# Altium schematic sheet FPGA_IO_3.SchDoc
size A
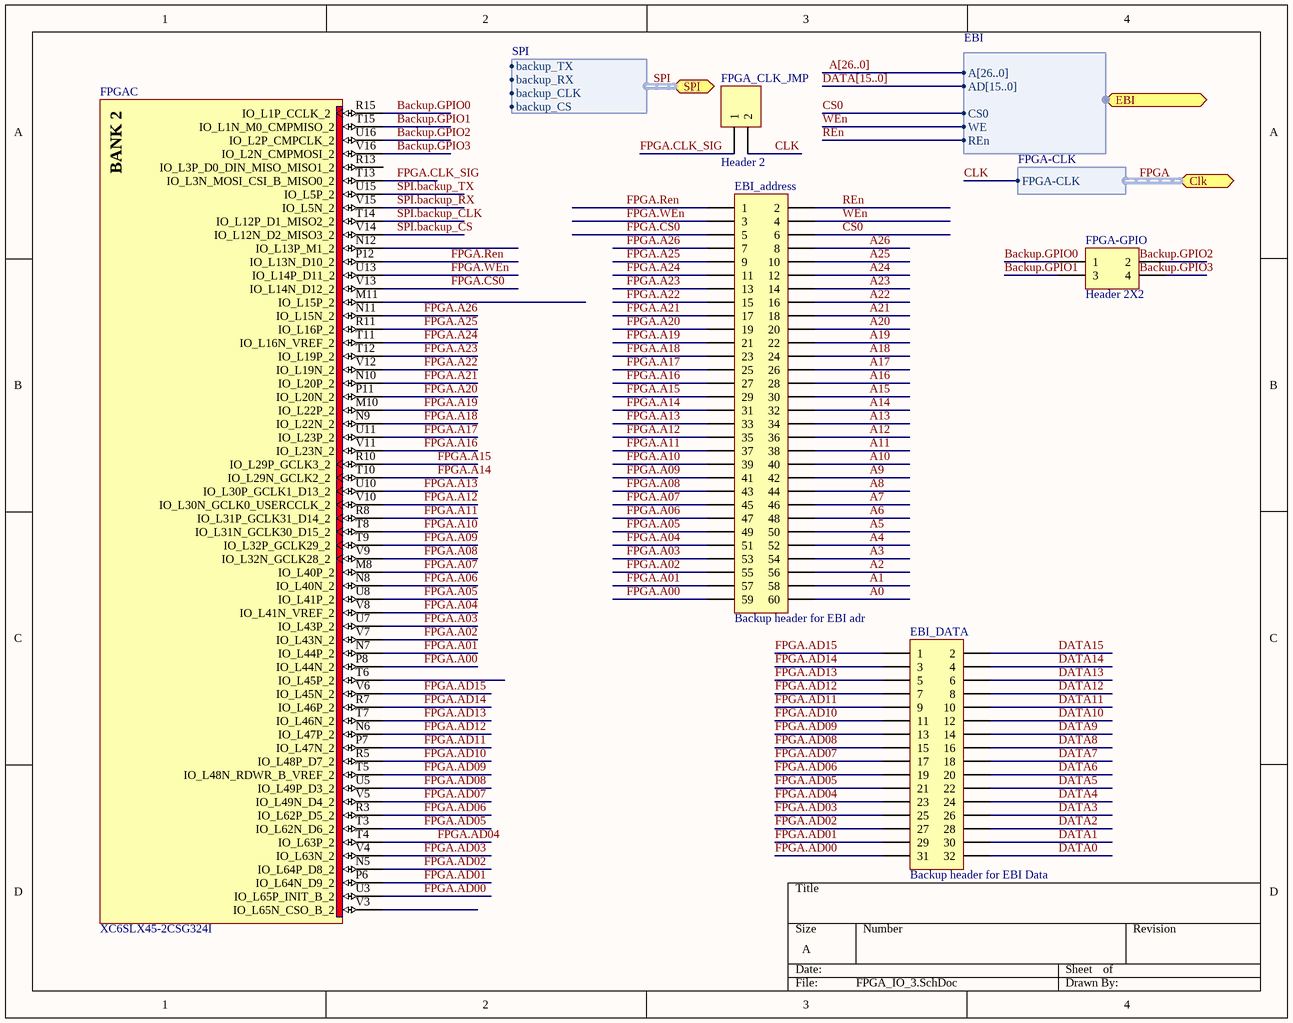
[diagram p0: FPGA_IO_3.SchDoc]

## Parts
EBI_address  Backup header for EBI adr  [HDR2X30]
EBI_DATA  Backup header for EBI Data  [HDR2X16]
FPGA  XC6SLX45-2CSG324I  [CSG324]  (part C of 8)
FPGA-GPIO  Header 2X2  [HDR2X2]
FPGA_CLK_JMP  Header 2  [HDR1X2]

## Ports
Clk (harness FPGA-CLK), EBI (harness EBI), SPI (harness SPI)

## Harnesses
EBI: AD[15..0], A[26..0], CS0, WE, REn
FPGA-CLK: FPGA-CLK
SPI: backup_TX, backup_RX, backup_CLK, backup_CS

## Nets
A0: EBI_address.60
A1: EBI_address.58
A2: EBI_address.56
A3: EBI_address.54
A4: EBI_address.52
A5: EBI_address.50
A6: EBI_address.48
A7: EBI_address.46
A8: EBI_address.44
A9: EBI_address.42
A10: EBI_address.40
A11: EBI_address.38
A12: EBI_address.36
A13: EBI_address.34
A14: EBI_address.32
A15: EBI_address.30
A16: EBI_address.28
A17: EBI_address.26
A18: EBI_address.24
A19: EBI_address.22
A20: EBI_address.20
A21: EBI_address.18
A22: EBI_address.16
A23: EBI_address.14
A24: EBI_address.12
A25: EBI_address.10
A26: EBI_address.8
Backup.GPIO0: FPGA.R15(IO_L1P_CCLK_2) FPGA-GPIO.1
Backup.GPIO1: FPGA.T15(IO_L1N_M0_CMPMISO_2) FPGA-GPIO.3
Backup.GPIO2: FPGA.U16(IO_L2P_CMPCLK_2)
Backup.GPIO3: FPGA.V16(IO_L2N_CMPMOSI_2)
CLK: FPGA_CLK_JMP.2 ; port Clk.FPGA-CLK
CS0: EBI_address.6 ; port EBI.CS0
DATA0: EBI_DATA.32
DATA1: EBI_DATA.30
DATA2: EBI_DATA.28
DATA3: EBI_DATA.26
DATA4: EBI_DATA.24
DATA5: EBI_DATA.22
DATA6: EBI_DATA.20
DATA7: EBI_DATA.18
DATA8: EBI_DATA.16
DATA9: EBI_DATA.14
DATA10: EBI_DATA.12
DATA11: EBI_DATA.10
DATA12: EBI_DATA.8
DATA13: EBI_DATA.6
DATA14: EBI_DATA.4
DATA15: EBI_DATA.2
FPGA.A00: EBI_address.59 FPGA.P8(IO_L44N_2)
FPGA.A01: EBI_address.57 FPGA.N7(IO_L44P_2)
FPGA.A02: EBI_address.55 FPGA.V7(IO_L43N_2)
FPGA.A03: EBI_address.53 FPGA.U7(IO_L43P_2)
FPGA.A04: EBI_address.51 FPGA.V8(IO_L41N_VREF_2)
FPGA.A05: EBI_address.49 FPGA.U8(IO_L41P_2)
FPGA.A06: EBI_address.47 FPGA.N8(IO_L40N_2)
FPGA.A07: EBI_address.45 FPGA.M8(IO_L40P_2)
FPGA.A08: EBI_address.43 FPGA.V9(IO_L32N_GCLK28_2)
FPGA.A09: EBI_address.41 FPGA.T9(IO_L32P_GCLK29_2)
FPGA.A10: EBI_address.39 FPGA.T8(IO_L31N_GCLK30_D15_2)
FPGA.A11: EBI_address.37 FPGA.R8(IO_L31P_GCLK31_D14_2)
FPGA.A12: EBI_address.35 FPGA.V10(IO_L30N_GCLK0_USERCCLK_2)
FPGA.A13: EBI_address.33 FPGA.U10(IO_L30P_GCLK1_D13_2)
FPGA.A14: EBI_address.31 FPGA.T10(IO_L29N_GCLK2_2)
FPGA.A15: EBI_address.29 FPGA.R10(IO_L29P_GCLK3_2)
FPGA.A16: EBI_address.27 FPGA.V11(IO_L23N_2)
FPGA.A17: EBI_address.25 FPGA.U11(IO_L23P_2)
FPGA.A18: EBI_address.23 FPGA.N9(IO_L22N_2)
FPGA.A19: EBI_address.21 FPGA.M10(IO_L22P_2)
FPGA.A20: EBI_address.19 FPGA.P11(IO_L20N_2)
FPGA.A21: EBI_address.17 FPGA.N10(IO_L20P_2)
FPGA.A22: EBI_address.15 FPGA.V12(IO_L19N_2)
FPGA.A23: EBI_address.13 FPGA.T12(IO_L19P_2)
FPGA.A24: EBI_address.11 FPGA.T11(IO_L16N_VREF_2)
FPGA.A25: EBI_address.9 FPGA.R11(IO_L16P_2)
FPGA.A26: EBI_address.7 FPGA.N11(IO_L15N_2)
FPGA.AD00: EBI_DATA.31 FPGA.U3(IO_L65P_INIT_B_2)
FPGA.AD01: EBI_DATA.29 FPGA.P6(IO_L64N_D9_2)
FPGA.AD02: EBI_DATA.27 FPGA.N5(IO_L64P_D8_2)
FPGA.AD03: EBI_DATA.25 FPGA.V4(IO_L63N_2)
FPGA.AD04: EBI_DATA.23 FPGA.T4(IO_L63P_2)
FPGA.AD05: EBI_DATA.21 FPGA.T3(IO_L62N_D6_2)
FPGA.AD06: EBI_DATA.19 FPGA.R3(IO_L62P_D5_2)
FPGA.AD07: EBI_DATA.17 FPGA.V5(IO_L49N_D4_2)
FPGA.AD08: EBI_DATA.15 FPGA.U5(IO_L49P_D3_2)
FPGA.AD09: EBI_DATA.13 FPGA.T5(IO_L48N_RDWR_B_VREF_2)
FPGA.AD10: EBI_DATA.11 FPGA.R5(IO_L48P_D7_2)
FPGA.AD11: EBI_DATA.9 FPGA.P7(IO_L47N_2)
FPGA.AD12: EBI_DATA.7 FPGA.N6(IO_L47P_2)
FPGA.AD13: EBI_DATA.5 FPGA.T7(IO_L46N_2)
FPGA.AD14: EBI_DATA.3 FPGA.R7(IO_L46P_2)
FPGA.AD15: EBI_DATA.1 FPGA.V6(IO_L45N_2)
FPGA.CLK_SIG: FPGA.T13(IO_L3N_MOSI_CSI_B_MISO0_2) FPGA_CLK_JMP.1
FPGA.CS0: EBI_address.5 FPGA.V13(IO_L14N_D12_2)
FPGA.Ren: EBI_address.1 FPGA.P12(IO_L13N_D10_2)
FPGA.WEn: EBI_address.3 FPGA.U13(IO_L14P_D11_2)
REn: EBI_address.2 ; port EBI.REn
SPI.backup_CLK: FPGA.T14(IO_L12P_D1_MISO2_2)
SPI.backup_CS: FPGA.V14(IO_L12N_D2_MISO3_2)
SPI.backup_RX: FPGA.V15(IO_L5N_2)
SPI.backup_TX: FPGA.U15(IO_L5P_2)
WEn: EBI_address.4 ; port EBI.WE

Not connected (* = marked no-connect by the designer): FPGA M11(IO_L15P_2) N12(IO_L13P_M1_2) R13(IO_L3P_D0_DIN_MISO_MISO1_2) T6(IO_L45P_2) V3(IO_L65N_CSO_B_2); FPGA-GPIO 2 4

## Buses and harness runs
bus A[26..0]
bus DATA[15..0]
harness FPGA = port Clk
harness SPI = port SPI

## Notes on the sheet
- Labels drawn without touching a wire or pin: Backup.GPIO2, Backup.GPIO3
- (in symbol CMP-0067-00402-1, part C) BANK 2

## Library data of the parts
EBI_address = Header 30X2: Header, 30-Pin, Dual row; LatestRevisionDate: 17-Jul-2002; LatestRevisionNote: Re-released for DXP Platform.; Publisher: Altium Limited
EBI_DATA = Header 16X2: Header, 16-Pin, Dual row; LatestRevisionDate: 17-Jul-2002; LatestRevisionNote: Re-released for DXP Platform.; Publisher: Altium Limited
FPGA = CMP-0067-00402-1: Spartan-6 LX 1.2V FPGA, 218 User I/Os, 324-Ball Chip-Scale BGA (0.8mm Pitch), Speed Grade 2, Industrial Grade, Pb-Free; Code_JEDEC: MO-275-KKAC-1; PackageDescription: 324-Ball Chip-Scale BGA (CSG324) Package, 0.8 mm Pitch; DatasheetVersion: ver1.6, Nov-2010; PackageVersion: ver1.1, Nov-2009; PackageReference: CSG324
FPGA-GPIO = Header 2X2: Header, 2-Pin, Dual row; LatestRevisionDate: 17-Jul-2002; LatestRevisionNote: Re-released for DXP Platform.; Publisher: Altium Limited
FPGA_CLK_JMP = Header 2: Header, 2-Pin; LatestRevisionDate: 17-Jul-2002; LatestRevisionNote: Re-released for DXP Platform.; Publisher: Altium Limited